# EAGLE design IN-17 tubes (EAGLE 9.1.3)
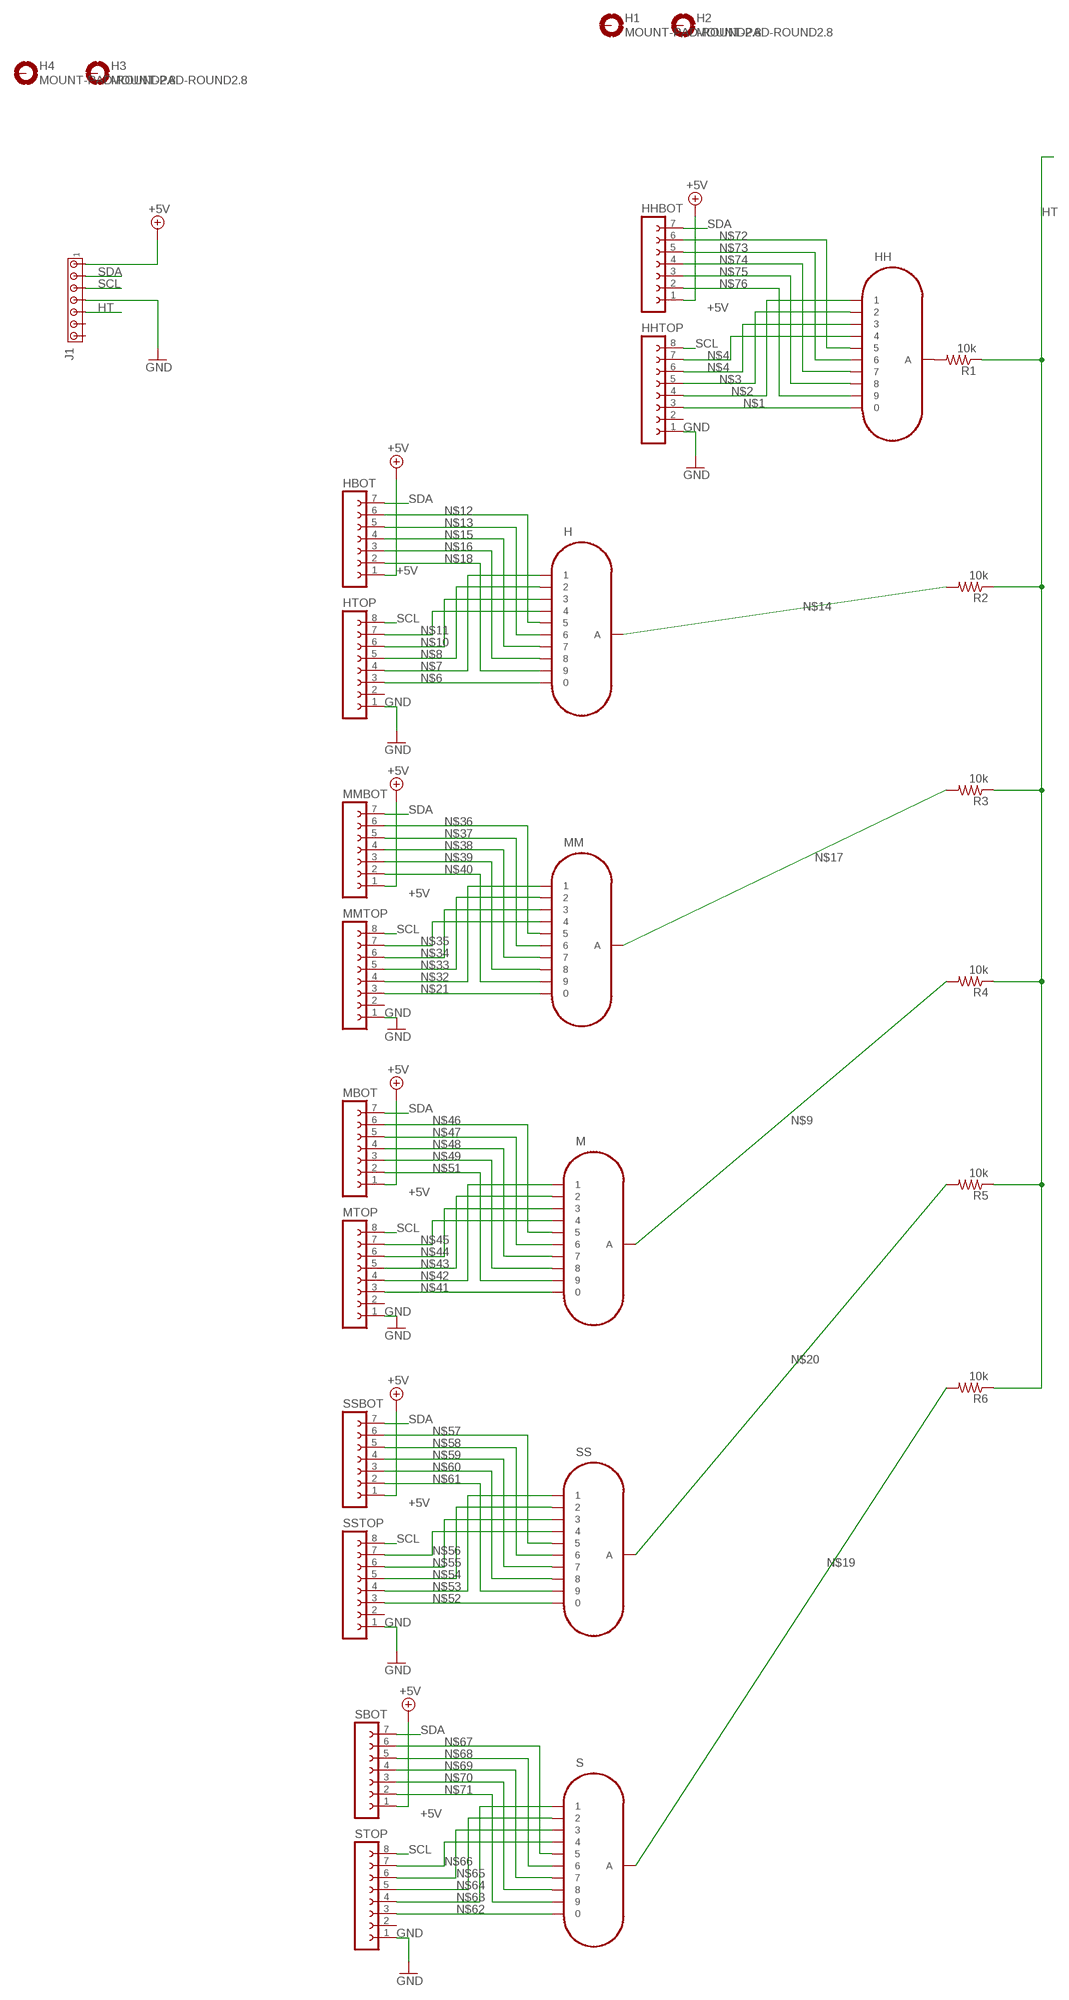
[diagram p0: schematic, sheet 1]

## Parts
H  IN-17  [IN-17]
H1  MOUNT-PAD-ROUND2.8  [2,8-PAD]
H2  MOUNT-PAD-ROUND2.8  [2,8-PAD]
H3  MOUNT-PAD-ROUND2.8  [2,8-PAD]
H4  MOUNT-PAD-ROUND2.8  [2,8-PAD]
HBOT  FE07-1  [FE07]
HH  IN-17  [IN-17]
HHBOT  FE07-1  [FE07]
HHTOP  FE08-1  [FE08]
HTOP  FE08-1  [FE08]
J1  MTA07-100  [10X07MTA]
M  IN-17  [IN-17]
MBOT  FE07-1  [FE07]
MM  IN-17  [IN-17]
MMBOT  FE07-1  [FE07]
MMTOP  FE08-1  [FE08]
MTOP  FE08-1  [FE08]
R1  10k  R-US_M0805  [M0805]
R2  10k  R-US_M0805  [M0805]
R3  10k  R-US_M0805  [M0805]
R4  10k  R-US_M0805  [M0805]
R5  10k  R-US_M0805  [M0805]
R6  10k  R-US_M0805  [M0805]
S  IN-17  [IN-17]
SBOT  FE07-1  [FE07]
SS  IN-17  [IN-17]
SSBOT  FE07-1  [FE07]
SSTOP  FE08-1  [FE08]
STOP  FE08-1  [FE08]

## Nets
+5V: HBOT.1 HHBOT.1 J1.1 MBOT.1 MMBOT.1 SBOT.1 SSBOT.1
GND: HHTOP.1 HTOP.1 J1.4 MMTOP.1 MTOP.1 SSTOP.1 STOP.1
HT: J1.5 R1.1 R2.1 R3.1 R4.1 R5.1 R6.1
N$1: HH.0 HHTOP.3
N$2: HH.1 HHTOP.4
N$3: HH.2 HHTOP.5
N$4: HH.3 HHTOP.6
N$5: HH.4 HHTOP.7
N$6: H.0 HTOP.3
N$7: H.1 HTOP.4
N$8: H.2 HTOP.5
N$9: M.A R4.2
N$10: H.3 HTOP.6
N$11: H.4 HTOP.7
N$12: H.5 HBOT.6
N$13: H.6 HBOT.5
N$14: H.A R2.2
N$15: H.7 HBOT.4
N$16: H.8 HBOT.3
N$17: MM.A R3.2
N$18: H.9 HBOT.2
N$19: R6.2 S.A
N$20: R5.2 SS.A
N$21: MM.0 MMTOP.3
N$32: MM.1 MMTOP.4
N$33: MM.2 MMTOP.5
N$34: MM.3 MMTOP.6
N$35: MM.4 MMTOP.7
N$36: MM.5 MMBOT.6
N$37: MM.6 MMBOT.5
N$38: MM.7 MMBOT.4
N$39: MM.8 MMBOT.3
N$40: MM.9 MMBOT.2
N$41: M.0 MTOP.3
N$42: M.1 MTOP.4
N$43: M.2 MTOP.5
N$44: M.3 MTOP.6
N$45: M.4 MTOP.7
N$46: M.5 MBOT.6
N$47: M.6 MBOT.5
N$48: M.7 MBOT.4
N$49: M.8 MBOT.3
N$50: HH.A R1.2
N$51: M.9 MBOT.2
N$52: SS.0 SSTOP.3
N$53: SS.1 SSTOP.4
N$54: SS.2 SSTOP.5
N$55: SS.3 SSTOP.6
N$56: SS.4 SSTOP.7
N$57: SS.5 SSBOT.6
N$58: SS.6 SSBOT.5
N$59: SS.7 SSBOT.4
N$60: SS.8 SSBOT.3
N$61: SS.9 SSBOT.2
N$62: S.0 STOP.3
N$63: S.1 STOP.4
N$64: S.2 STOP.5
N$65: S.3 STOP.6
N$66: S.4 STOP.7
N$67: S.5 SBOT.6
N$68: S.6 SBOT.5
N$69: S.7 SBOT.4
N$70: S.8 SBOT.3
N$71: S.9 SBOT.2
N$72: HH.5 HHBOT.6
N$73: HH.6 HHBOT.5
N$74: HH.7 HHBOT.4
N$75: HH.8 HHBOT.3
N$76: HH.9 HHBOT.2
SCL: HHTOP.8 HTOP.8 J1.3 MMTOP.8 MTOP.8 SSTOP.8 STOP.8
SDA: HBOT.7 HHBOT.7 J1.2 MBOT.7 MMBOT.7 SBOT.7 SSBOT.7
Unconnected: H1.B2,8(MOUNT) H2.B2,8(MOUNT) H3.B2,8(MOUNT) H4.B2,8(MOUNT) HHTOP.2 HTOP.2 J1.6 J1.7 MMTOP.2 MTOP.2 SSTOP.2 STOP.2

## Library data of the parts
H HH M MM S SS = russian-nixies:IN-17: IN-17: tiny numeric topview nixie tube
H1-H4 = holes:MOUNT-PAD-ROUND: MOUNTING PAD, round
HBOT HHBOT MBOT MMBOT SBOT SSBOT = con-lsta:FE07-1: FEMALE HEADER; OC_FARNELL: unknown; OC_NEWARK: unknown
HHTOP HTOP MMTOP MTOP SSTOP STOP = con-lsta:FE08-1: FEMALE HEADER; OC_FARNELL: unknown; OC_NEWARK: unknown
J1 = con-amp:MTA07-100: AMP connector
R1-R6 = adafruit:R-US_: RESISTOR, American symbol

## Board
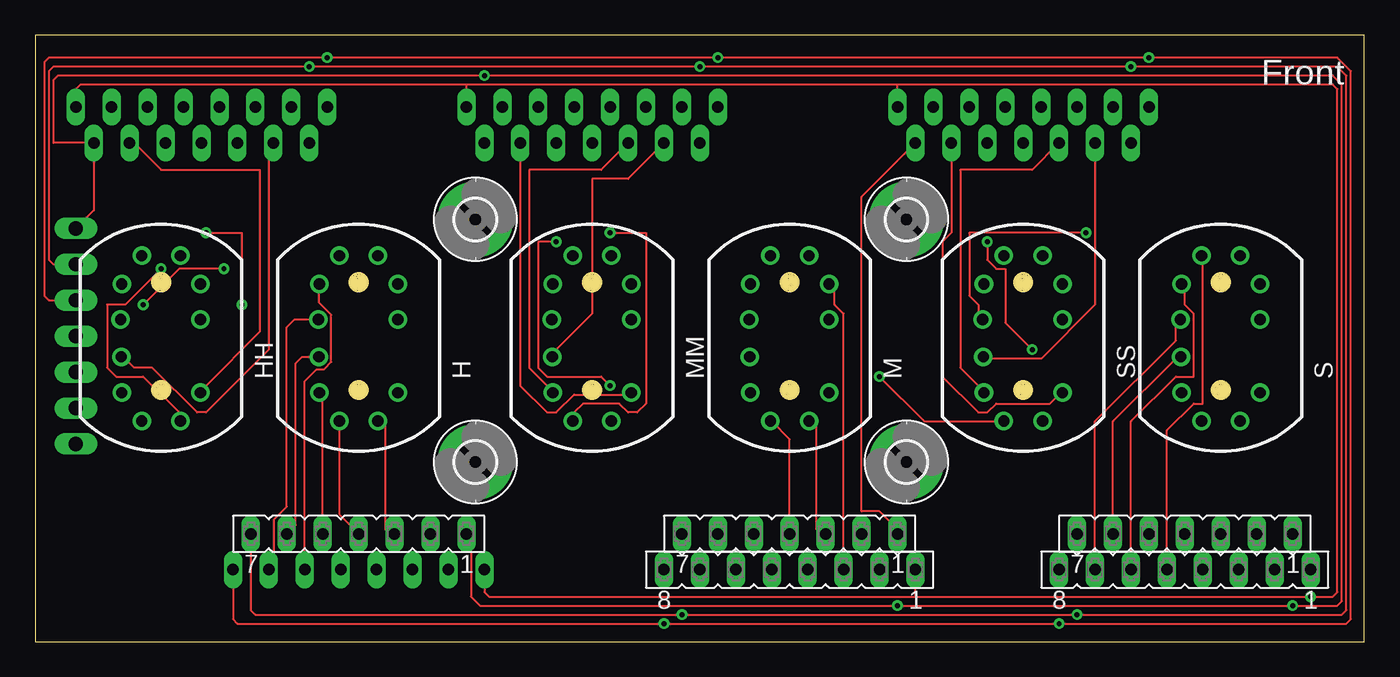
[diagram p1: board, top side]
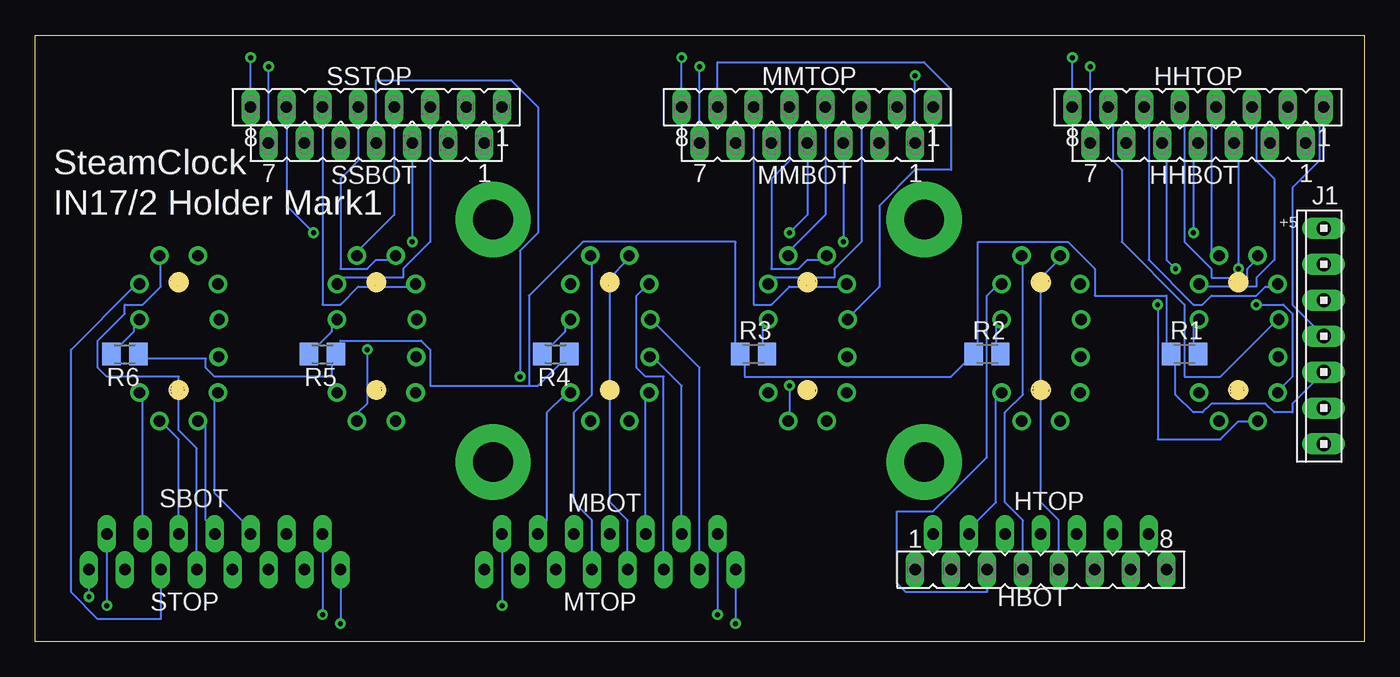
[diagram p2: board, bottom side, seen from below]

Size 93.96 x 42.85 mm. Coordinates in mm from the lower left corner, seen from the top.
Outline: 0,0 93.96,0 93.96,42.85 0,42.85 0,0
Copper layers (1*16): Top 0.035mm / dielectric 1.5mm / Bottom 0.035mm
Design rules "default": minimum track width 6mil, minimum drill 0.35mm, track to track 6mil, track to pad 6mil, pad to pad 6mil, via to via 6mil, smd to smd 6mil, copper to edge 40mil, drill to drill 6mil, minimum pad ring 10mil, minimum via ring 8mil, stop-mask expansion 4mil, vias tented up to drill 0mil, thermal gap 10mil

### Footprints (pad centres in the part's own frame; a part is rotated, then mirrored left to right if it is on the bottom)
IN-17 = drill 0.8: 0 2.777,4; 1 1.365,6; 2 -1.365,6; 3 -2.778,4; 4 -2.858,1.5; 5 -2.818,-1.143; 6 -2.778,-3.683; 7 -1.365,-5.683; 8 1.365,-5.683; 9 2.777,-3.683; A 2.777,1.5
2,8-PAD = drill 2.8 pad 5.334: B2,8 0,0
FE07 = drill 0.813 long: 1 -7.62,0; 2 -5.08,0; 3 -2.54,0; 4 0,0; 5 2.54,0; 6 5.08,0; 7 7.62,0
FE08 = drill 0.813 long: 1 -8.89,0; 2 -6.35,0; 3 -3.81,0; 4 -1.27,0; 5 1.27,0; 6 3.81,0; 7 6.35,0; 8 8.89,0
10X07MTA = drill 1.016 long: 1 7.62,0; 2 5.08,0; 3 2.54,0; 4 0,0; 5 -2.54,0; 6 -5.08,0; 7 -7.62,0
M0805 = smd 1.3 x 1.6: 1 -0.95,0; 2 0.95,0

### Placement (x,y rotation side)
H  22.86,21.27 0 top
H1  31.11,12.7 0 top
H2  61.59,12.7 0 top
H3  61.59,29.85 0 top
H4  31.11,29.85 0 top
HBOT  22.86,7.62 180 top
HH  8.89,21.27 0 top
HHBOT  11.75,35.24 180 bottom
HHTOP  11.75,37.78 180 bottom
HTOP  22.86,5.08 0 bottom
J1  2.86,21.59 90 bottom
M  53.34,21.27 0 top
MBOT  53.34,7.62 180 top
MM  39.37,21.27 0 top
MMBOT  39.37,35.24 180 bottom
MMTOP  39.37,37.78 180 bottom
MTOP  53.34,5.08 180 top
R1  12.7,20.32 0 bottom
R2  26.67,20.32 0 bottom
R3  43.18,20.32 0 bottom
R4  57.15,20.32 180 bottom
R5  73.66,20.32 180 bottom
R6  87.63,20.32 180 bottom
S  83.82,21.27 0 top
SBOT  81.28,7.62 180 top
SS  69.85,21.27 0 top
SSBOT  69.85,35.24 180 bottom
SSTOP  69.85,37.78 180 bottom
STOP  81.28,5.08 180 top

### Tracks (layer width: path | path; a pad name or v marks a point on that pad's centre or on a via)
+5V  (via drill 0.35)
  Top 0.152: HBOT.1 30.8,7.3 30.8,3.18 31.43,2.54 v60.96,2.54 v88.9,2.54 92.08,2.54 92.39,2.86 92.39,39.37 91.76,40 v31.75,40 1.59,40 1.27,39.69 1.27,35.24 HHBOT.1 4.13,30.48 J1.1 | SSBOT.1 58.42,31.43 58.42,9.21 59.69,9.21 60.96,7.94 MBOT.1
  Bottom 0.152: MBOT.1 v60.96,2.54 | SBOT.1 v88.9,2.54 | MMBOT.1 v31.75,40
GND  (via drill 0.35)
  Top 0.152: HTOP.1 31.75,3.49 32.07,3.18 62.23,3.18 | 62.23,3.18 MTOP.1 | 62.23,3.18 v90.17,3.18 91.76,3.18 92.08,3.49 92.08,39.05 91.76,39.37 60.96,39.37 | HHTOP.1 2.86,39.05 3.18,39.37 30.48,39.37 | 60.96,39.37 30.48,39.37 | MMTOP.1 30.48,39.37 | SSTOP.1 60.96,39.37
  Bottom 0.152: STOP.1 v90.17,3.18 | J1.4 5.08,23.81 5.08,32.07 3.18,33.97 3.18,37.78 HHTOP.1
HT
  Bottom 0.152: 59.06,18.1 66.04,18.1 66.04,20.64 66.67,21.27 72.39,21.27 72.39,20.64 R5.1 73.03,20 73.03,18.73 81.28,18.73 81.92,19.37 81.92,20 86.36,20 R6.1 | 59.06,18.1 58.42,18.1 56.52,20 R4.1 | J1.5 5.08,16.83 5.08,16.19 6.35,16.19 6.98,16.83 10.79,16.83 11.43,16.19 12.06,16.19 13.33,17.46 13.33,20 R1.1 13.97,20.64 13.97,24.45 19.05,24.45 19.05,26.35 20.96,28.26 27.3,28.26 27.3,20.64 R2.1 27.94,20 29.21,18.73 43.81,18.73 43.81,20 R3.1 44.45,20.64 44.45,28.26 55.25,28.26 59.06,24.45 59.06,18.1
N$1
  Bottom 0.152: HH.0 11.43,25.08 7.62,25.08 7.62,25.72 6.35,26.99 6.35,32.7 7.62,33.97 7.62,37.78 HHTOP.3
N$2
  Bottom 0.152: HH.1 10.79,27.62 10.79,37.78 HHTOP.4
N$3
  Bottom 0.152: HH.2 7.62,26.99 8.25,26.35 8.25,25.72 10.79,25.72 10.79,26.35 12.7,28.26 12.7,37.78 HHTOP.5
N$4
  Bottom 0.152: HH.3 6.35,25.08 6.98,25.08 7.62,24.45 10.79,24.45 11.43,23.81 12.06,23.81 15.24,26.99 15.24,37.78 HHTOP.6
N$5
  Bottom 0.152: HH.4 6.35,22.54 10.16,18.73 12.7,18.73 12.7,23.81 17.14,28.26 17.14,33.34 17.78,33.97 17.78,37.78 HHTOP.7
N$6
  Bottom 0.152: HTOP.3 26.67,3.49 32.39,3.49 33.02,4.13 33.02,9.21 30.48,9.21 26.67,13.02 26.67,24.45 26.04,25.08 H.0
N$7
  Bottom 0.152: HTOP.4 24.13,8.57 25.4,9.84 25.4,16.19 24.13,17.46 24.13,26.99 H.1
N$8
  Bottom 0.152: HTOP.5 21.59,8.57 22.86,9.84 22.86,25.72 21.59,26.99 H.2
N$9
  Bottom 0.152: R4.2 57.78,20.64 56.52,21.91 56.52,22.54 M.A
N$10
  Top 0.152: HTOP.6 19.05,18.41 19.88,19.25 20.41,19.25 20.93,19.76 20.93,23.1 20.08,23.94 H.3
N$11
  Top 0.152: HTOP.7 16.89,5.46 16.89,8.65 17.78,9.54 17.78,22.23 18.33,22.77 H.4
N$12
  Top 0.152: HBOT.6 18.42,8.25 18.42,19.68 18.86,20.13 H.5
N$13
  Top 0.152: HBOT.5 20.32,17.35 H.6
N$14
  Bottom 0.152: R2.2 26.04,20.64 26.04,22.54 H.A
N$15
  Top 0.152: H.7 21.5,8.99 HBOT.4
N$16
  Top 0.152: H.8 24.76,15.56 24.76,7.94 25.4,7.94 HBOT.3
N$17
  Bottom 0.152: R3.2 42.55,20.64 42.55,22.54 MM.A
N$18
  Bottom 0.152: H.9 26.04,17.46 26.04,9.84 27.94,7.94 HBOT.2
N$19
  Bottom 0.152: R6.2 88.27,20.64 87,21.91 87,22.54 S.A
N$20
  Bottom 0.152: R5.2 74.3,20.64 73.03,21.91 73.03,22.54 SS.A
N$21
  Bottom 0.152: MMTOP.3 35.56,28.26 37.47,26.35 37.47,25.72 41.91,25.72 MM.0
N$32
  Bottom 0.152: MMTOP.4 38.1,30.16 40.64,27.62 MM.1
N$33
  Bottom 0.152: MMTOP.5 40.64,33.97 41.91,32.7 41.91,26.35 40,26.35 39.37,26.99 38.1,26.99 MM.2
N$34
  Bottom 0.152: MMTOP.6 43.18,23.81 41.91,23.81 40.64,25.08 36.83,25.08 MM.3
N$35
  Bottom 0.152: MMTOP.7 45.72,40.96 31.11,40.96 29.21,39.05 29.21,33.34 31.75,33.34 34.29,30.8 34.29,25.08 36.19,23.18 MM.4
N$36
  Top 0.152: MMBOT.6 41.91,32.7 39.37,32.7 39.37,23.18 36.83,20.64 MM.5
N$37
  Top 0.152: MMBOT.5 40,33.34 34.92,33.34 34.92,19.37 36.19,18.1 MM.6
N$38  (via drill 0.35)
  Top 0.152: v40.64,28.89 43.18,28.89 43.18,16.83 42.55,16.19 41.91,16.19 41.28,16.83 38.73,16.83 38.1,16.19 MM.7
  Bottom 0.152: v40.64,28.89 39.37,30.16 MMBOT.4
N$39  (via drill 0.35)
  Top 0.152: v40.64,18.1 40,18.73 36.19,18.73 35.56,19.37 35.56,28.26 v36.83,28.26
  Bottom 0.152: v40.64,18.1 40.64,16.19 MM.8 | MMBOT.3 v36.83,28.26
N$40
  Top 0.152: MMBOT.2 34.29,18.1 36.19,16.19 36.83,16.19 38.1,17.46 41.91,17.46 MM.9
N$41
  Top 0.152: MTOP.3 57.15,23.18 56.52,23.81 56.52,25.08 M.0
N$42
  Bottom 0.152: MTOP.4 54.61,8.57 55.88,9.84 55.88,16.19 54.61,17.46 54.61,26.99 M.1
N$43
  Bottom 0.152: MTOP.5 52.07,8.57 53.34,9.84 53.34,25.72 52.07,26.99 M.2
N$44
  Bottom 0.152: MTOP.6 49.53,18.73 50.8,18.73 51.44,19.37 51.44,24.45 50.8,25.08 M.3
N$45
  Bottom 0.152: MTOP.7 46.99,19.37 50.17,22.54 M.4
N$46
  Bottom 0.152: MBOT.6 48.26,18.1 50.17,20 M.5
N$47
  Bottom 0.152: MBOT.5 50.8,17.46 M.6
N$48
  Top 0.152: MBOT.4 53.34,14.29 52.07,15.56 M.7
N$49
  Top 0.152: M.8 55.25,15.56 55.25,7.94 55.88,7.94 MBOT.3
N$50
  Bottom 0.152: R1.2 12.06,20.64 12.06,22.54 HH.A
N$51
  Bottom 0.152: M.9 56.52,17.46 57.78,16.19 57.78,8.57 58.42,7.94 MBOT.2
N$52
  Bottom 0.152: SSTOP.3 66.04,28.26 67.95,26.35 67.95,25.72 72.39,25.72 SS.0
N$53
  Bottom 0.152: SSTOP.4 68.58,30.16 71.12,27.62 SS.1
N$54
  Bottom 0.152: SSTOP.5 71.12,33.97 72.39,32.7 72.39,26.35 70.48,26.35 69.85,26.99 68.58,26.99 SS.2
N$55
  Bottom 0.152: SSTOP.6 73.66,23.81 72.39,23.81 71.12,25.08 67.31,25.08 SS.3
N$56  (via drill 0.35)
  Top 0.152: v74.3,28.89 66.04,28.89 66.04,24.45 66.67,23.81 66.67,23.18 SS.4
  Bottom 0.152: v74.3,28.89 76.2,30.8 SSTOP.7
N$57
  Top 0.152: SSBOT.6 74.93,23.81 71.12,20 67.31,20 SS.5
N$58
  Top 0.152: SSBOT.5 70.48,33.34 65.41,33.34 65.41,19.37 66.67,18.1 SS.6
N$59  (via drill 0.35)
  Top 0.152: v59.69,18.73 62.87,15.56 67.95,15.56 SS.7
  Bottom 0.152: v59.69,18.73 59.69,27.62 58.42,28.89 58.42,37.78 60.33,39.69 69.85,39.69 SSBOT.4
N$60  (via drill 0.35)
  Top 0.152: v70.48,20.64 68.58,22.54 68.58,26.35 67.95,26.35 67.31,26.99 v67.31,28.26
  Bottom 0.152: v70.48,20.64 70.48,16.83 71.12,16.19 SS.8 | SSBOT.3 v67.31,28.26
N$61
  Top 0.152: SSBOT.2 64.77,28.89 64.14,28.26 64.14,18.73 66.67,16.19 67.31,16.19 67.95,16.83 71.76,16.83 72.39,17.46 SS.9
N$62
  Bottom 0.152: STOP.3 85.09,1.59 89.53,1.59 91.44,3.49 91.44,20.64 87,25.08 S.0
N$63
  Bottom 0.152: STOP.4 82.55,13.65 83.82,14.92 83.82,18.73 88.9,18.73 89.53,19.37 89.53,21.27 87.63,23.18 87.63,23.81 86.36,23.81 85.09,25.08 85.09,26.99 S.1
N$64
  Top 0.152: STOP.5 80.01,14.92 81.92,16.83 82.55,16.83 82.55,26.99 S.2
N$65
  Top 0.152: STOP.6 77.47,15.56 80.64,18.73 81.92,18.73 81.92,23.18 81.28,23.81 81.28,25.08 S.3
N$66
  Top 0.152: STOP.7 74.93,15.56 80.64,21.27 80.64,22.54 S.4
N$67
  Top 0.152: SBOT.6 76.2,15.56 80.64,20 S.5
N$68
  Bottom 0.152: S.6 81.28,17.46 81.28,10.48 78.74,7.94 SBOT.5
N$69
  Bottom 0.152: S.7 81.92,15.56 81.92,8.57 81.28,7.94 SBOT.4
N$70
  Bottom 0.152: SBOT.3 83.82,14.29 85.09,15.56 S.8
N$71
  Bottom 0.152: SBOT.2 86.36,17.46 S.9
N$72
  Top 0.152: HH.5 6.35,20 6.98,19.37 8.25,19.37 11.43,16.19 12.06,16.19 16.51,20.64 16.51,35.24 HHBOT.6
N$73  (via drill 0.35)
  Top 0.152: v7.62,23.81 10.16,26.35 v13.33,26.35
  Bottom 0.152: v7.62,23.81 5.71,23.81 5.08,23.18 5.08,18.73 5.71,18.1 HH.6 | v13.33,26.35 13.97,26.99 13.97,35.24 HHBOT.5
N$74  (via drill 0.35)
  Top 0.152: v14.61,23.81 14.61,28.89 v12.06,28.89
  Bottom 0.152: v14.61,23.81 14.61,14.29 10.16,14.29 8.89,15.56 7.62,15.56 HH.7 | v12.06,28.89 12.06,35.24 HHBOT.4
N$75  (via drill 0.35)
  Top 0.152: v8.89,26.35 6.35,23.81 5.08,23.81 5.08,19.37 5.71,18.73 7.62,18.73 10.16,16.19 HH.8
  Bottom 0.152: v8.89,26.35 8.89,35.24 HHBOT.3
N$76
  Top 0.152: HH.9 12.06,18.1 15.87,21.91 15.87,33.34 8.89,33.34 6.98,35.24 HHBOT.2
SCL  (via drill 0.35)
  Top 0.152: HTOP.8 13.97,1.59 14.29,1.27 v44.45,1.27 v72.39,1.27 92.71,1.27 93.03,1.59 93.03,40.32 92.08,41.28 v78.74,41.28 v48.26,41.28 v20.64,41.28 0.95,41.28 0.63,40.96 0.63,24.45 0.95,24.13 J1.3
  Bottom 0.152: MTOP.8 v44.45,1.27 | STOP.8 v72.39,1.27 | SSTOP.8 v78.74,41.28 | HHTOP.8 v20.64,41.28 | MMTOP.8 v48.26,41.28
SDA  (via drill 0.35)
  Top 0.152: HBOT.7 15.24,2.22 15.56,1.91 v45.72,1.91 v73.66,1.91 92.39,1.91 92.71,2.22 92.71,40 92.08,40.64 v77.47,40.64 v46.99,40.64 v19.37,40.64 1.27,40.64 0.95,40.32 0.95,26.99 1.27,26.67 J1.2
  Bottom 0.152: MBOT.7 v45.72,1.91 | SBOT.7 v73.66,1.91 | SSBOT.7 v77.47,40.64 | HHBOT.7 v19.37,40.64 | MMBOT.7 v46.99,40.64

### Text on the board
tNames: Front
bNames: SteamClock | IN17/2 Holder Mark1 | +5